# Altium schematic sheet DRV8825_MODE.SchDoc
size A4
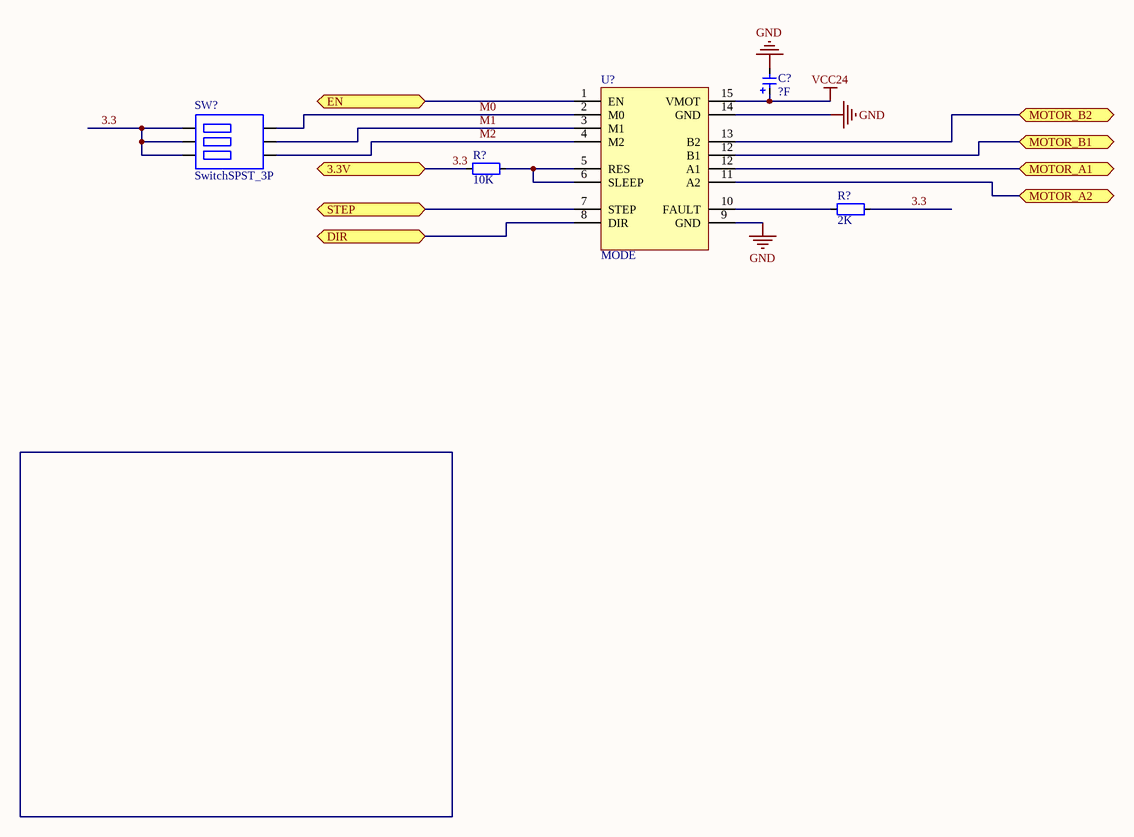
[diagram p0: DRV8825_MODE.SchDoc]

## Parts
(Parts that share a designator on the sheet are numbered #1, #2 ... from top to bottom, then left to right.)
C?  value ?F  [CAPAE6666X77M]  (hidden comment: Cap_63*77)
R?#1  value 10K  [RES_0603]  (hidden comment: Res_0603)
R?#2  value 2K  [RES_0603]  (hidden comment: Res_0603)
SW?  SwitchSPST_3P  [SwitchSPDT_P2_180]
U?  MODE  [drv8825mode]

## Ports
3.3V, DIR, EN, MOTOR_A1, MOTOR_A2, MOTOR_B1, MOTOR_B2, STEP

## Nets
GND: C?.2 U?.9(GND) U?.14(GND)
VCC24: C?.1 U?.15(VMOT)
3.3: R?#1.1 R?#2.2 SW?.1ON(ON) SW?.2ON(NO) SW?.3ON(NO) ; port 3.3V
DIR: U?.8(DIR) ; port DIR
EN: U?.1(EN) ; port EN
M0: SW?.3(COMMON) U?.2(M0)
M1: SW?.2(COMMON) U?.3(M1)
M2: SW?.1(COMMON) U?.4(M2)
MOTOR_A1: U?.12(A1) ; port MOTOR_A1
MOTOR_A2: U?.11(A2) ; port MOTOR_A2
MOTOR_B1: U?.12(B1) ; port MOTOR_B1
MOTOR_B2: U?.13(B2) ; port MOTOR_B2
STEP: U?.7(STEP) ; port STEP
NetR?#1_2: R?#1.2 U?.5(RES) U?.6(SLEEP)
NetR?#2_1: R?#2.1 U?.10(FAULT)

## Library data of the parts
C? = Cap_Tan_0805: Capacitor
R?#1 R?#2 = Res_0603: Resistor
SW? = SwitchSPST_3P: Switch
U? = DRV8825_MODE